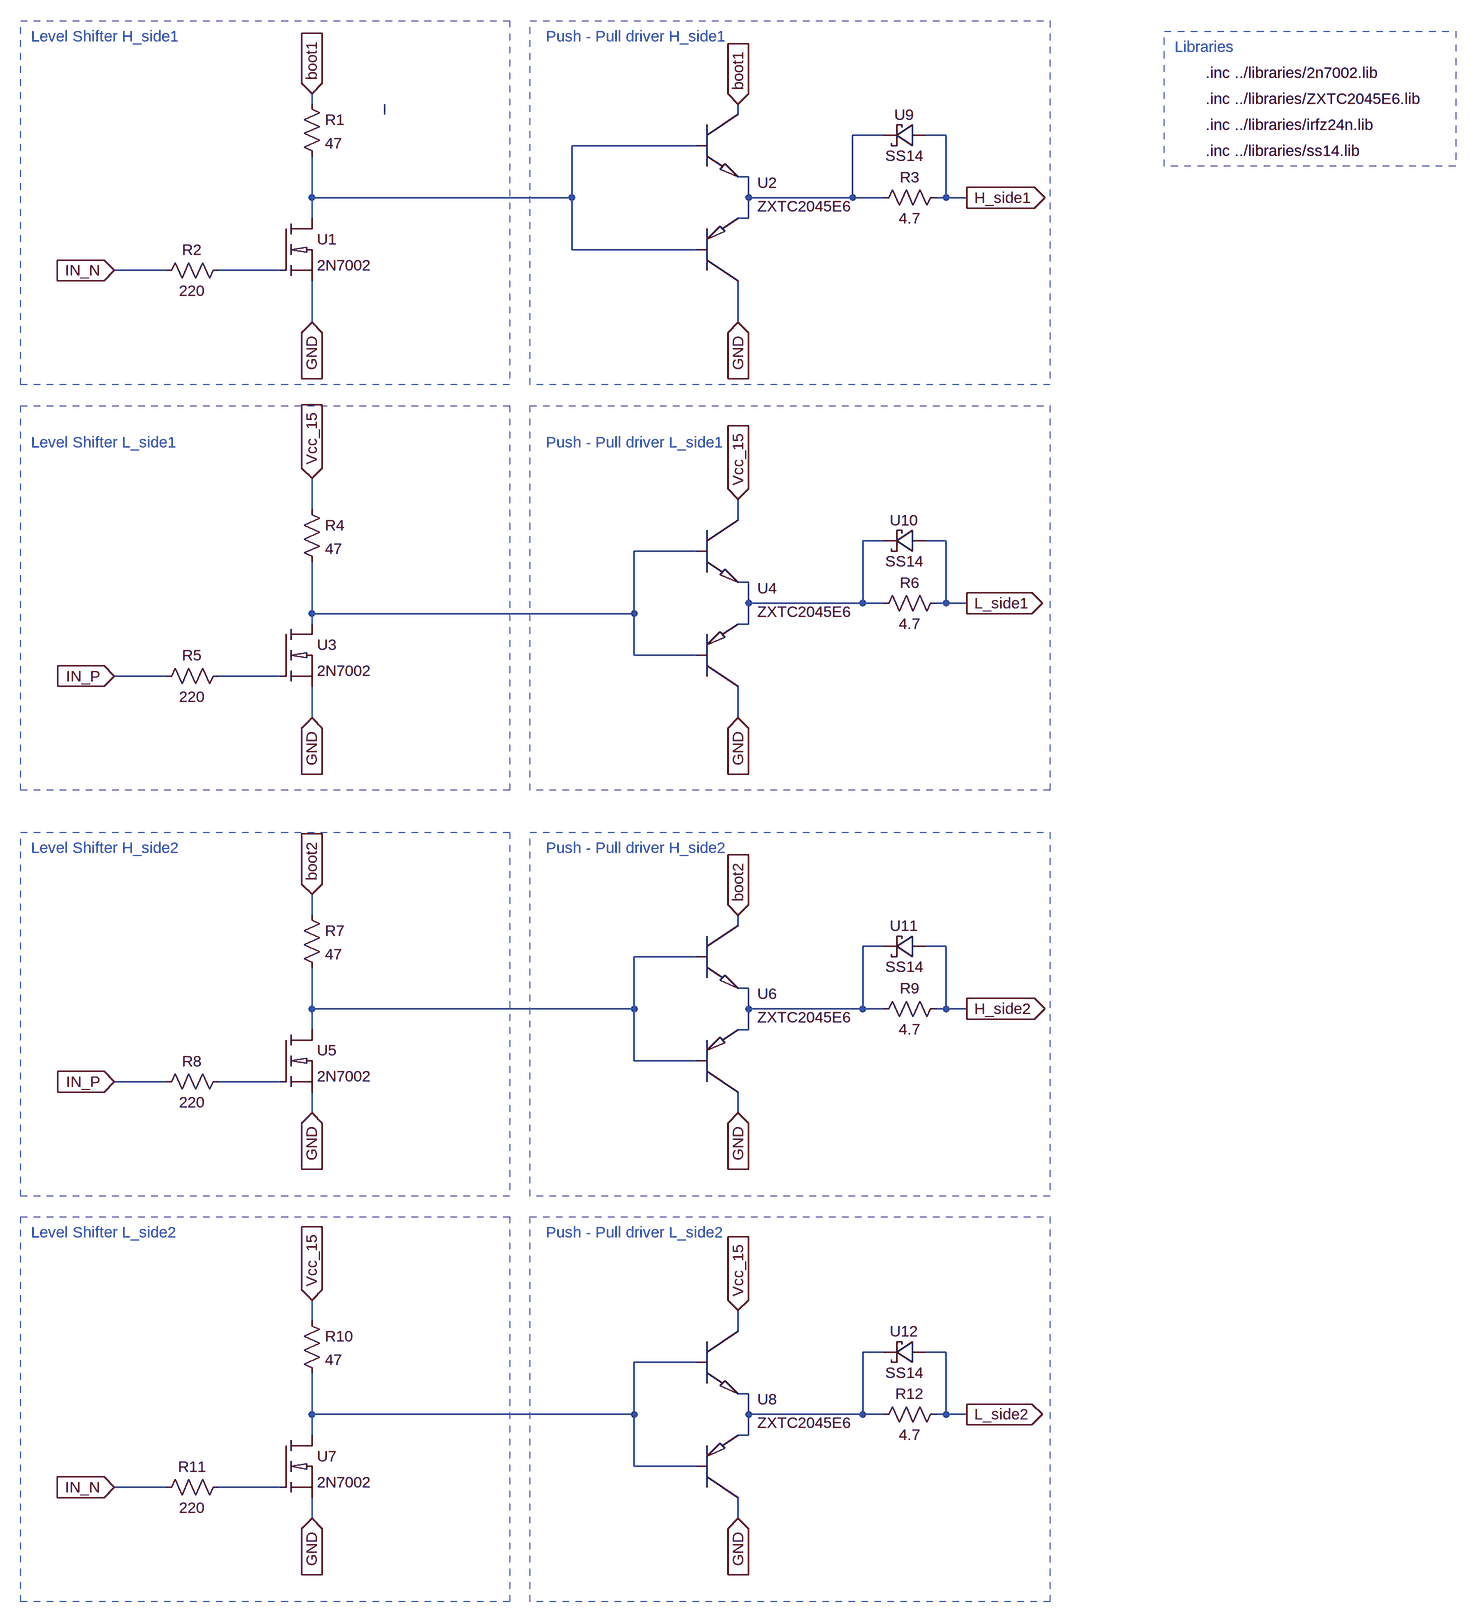
[diagram p0: schematic GateDriver_component.asc]
GateDriver_component.asc, the LTspice schematic file:
Version 4
SHEET 1 3956 2420
WIRE -384 112 -384 96
WIRE -272 128 -272 112
WIRE 272 128 272 112
WIRE 496 160 448 160
WIRE 592 160 560 160
WIRE 208 176 16 176
WIRE 288 224 272 224
WIRE -384 256 -384 192
WIRE 16 256 16 176
WIRE 16 256 -384 256
WIRE 288 256 288 224
WIRE 448 256 448 160
WIRE 448 256 288 256
WIRE 496 256 448 256
WIRE 592 256 592 160
WIRE 592 256 576 256
WIRE 624 256 592 256
WIRE -384 288 -384 256
WIRE 288 288 288 256
WIRE 288 288 272 288
WIRE 16 336 16 256
WIRE 208 336 16 336
WIRE -608 368 -688 368
WIRE -432 368 -528 368
WIRE -384 448 -384 384
WIRE 272 448 272 384
WIRE -384 736 -384 688
WIRE 272 752 272 720
WIRE 496 784 464 784
WIRE 592 784 560 784
WIRE 208 800 112 800
WIRE 288 848 272 848
WIRE 288 880 288 848
WIRE 464 880 464 784
WIRE 464 880 288 880
WIRE 496 880 464 880
WIRE 592 880 592 784
WIRE 592 880 576 880
WIRE 624 880 592 880
WIRE -384 896 -384 816
WIRE 112 896 112 800
WIRE 112 896 -384 896
WIRE -384 912 -384 896
WIRE 288 912 288 880
WIRE 288 912 272 912
WIRE 112 960 112 896
WIRE 208 960 112 960
WIRE -608 992 -688 992
WIRE -432 992 -528 992
WIRE -384 1056 -384 1008
WIRE 272 1056 272 1008
WIRE -384 1360 -384 1328
WIRE 272 1376 272 1360
WIRE 496 1408 464 1408
WIRE 592 1408 560 1408
WIRE 208 1424 112 1424
WIRE 288 1472 272 1472
WIRE -384 1504 -384 1440
WIRE 112 1504 112 1424
WIRE 112 1504 -384 1504
WIRE 288 1504 288 1472
WIRE 464 1504 464 1408
WIRE 464 1504 288 1504
WIRE 496 1504 464 1504
WIRE 592 1504 592 1408
WIRE 592 1504 576 1504
WIRE 624 1504 592 1504
WIRE -384 1536 -384 1504
WIRE 288 1536 288 1504
WIRE 288 1536 272 1536
WIRE 112 1584 112 1504
WIRE 208 1584 112 1584
WIRE -608 1616 -688 1616
WIRE -432 1616 -528 1616
WIRE -384 1664 -384 1632
WIRE 272 1664 272 1632
WIRE -384 1984 -384 1952
WIRE 272 2000 272 1968
WIRE 496 2032 464 2032
WIRE 592 2032 560 2032
WIRE 208 2048 112 2048
WIRE 288 2096 272 2096
WIRE -384 2128 -384 2064
WIRE 112 2128 112 2048
WIRE 112 2128 -384 2128
WIRE 288 2128 288 2096
WIRE 464 2128 464 2032
WIRE 464 2128 288 2128
WIRE 496 2128 464 2128
WIRE 592 2128 592 2032
WIRE 592 2128 576 2128
WIRE 624 2128 592 2128
WIRE -384 2160 -384 2128
WIRE 288 2160 288 2128
WIRE 288 2160 272 2160
WIRE 112 2208 112 2128
WIRE 208 2208 112 2208
WIRE -608 2240 -688 2240
WIRE -432 2240 -528 2240
WIRE -384 2288 -384 2256
WIRE 272 2288 272 2256
FLAG -688 368 IN_N
IOPIN -688 368 In
FLAG -384 96 boot1
IOPIN -384 96 In
FLAG 272 112 boot1
IOPIN 272 112 In
FLAG 624 256 H_side1
IOPIN 624 256 Out
FLAG -688 992 IN_P
IOPIN -688 992 In
FLAG -384 688 Vcc_15
IOPIN -384 688 In
FLAG 272 720 Vcc_15
IOPIN 272 720 In
FLAG 624 880 L_side1
IOPIN 624 880 Out
FLAG -688 1616 IN_P
IOPIN -688 1616 In
FLAG -384 1328 boot2
IOPIN -384 1328 In
FLAG 272 1360 boot2
IOPIN 272 1360 In
FLAG 624 1504 H_side2
IOPIN 624 1504 Out
FLAG -688 2240 IN_N
IOPIN -688 2240 In
FLAG -384 1952 Vcc_15
IOPIN -384 1952 In
FLAG 272 1968 Vcc_15
IOPIN 272 1968 In
FLAG 624 2128 L_side2
IOPIN 624 2128 Out
FLAG -384 448 GND
IOPIN -384 448 In
FLAG 272 448 GND
IOPIN 272 448 In
FLAG -384 1056 GND
IOPIN -384 1056 In
FLAG 272 1056 GND
IOPIN 272 1056 In
FLAG -384 1664 GND
IOPIN -384 1664 In
FLAG 272 1664 GND
IOPIN 272 1664 In
FLAG -384 2288 GND
IOPIN -384 2288 In
FLAG 272 2288 GND
IOPIN 272 2288 In
SYMBOL 2n7002 -432 288 R0
SYMATTR InstName U1
SYMBOL res -400 96 R0
SYMATTR InstName R1
SYMATTR Value 47
SYMBOL res -512 352 R90
WINDOW 0 0 56 VBottom 2
WINDOW 3 32 56 VTop 2
SYMATTR InstName R2
SYMATTR Value 220
SYMBOL ZXTC2045E6 208 144 R0
SYMATTR InstName U2
SYMBOL res 592 240 R90
WINDOW 0 0 56 VBottom 2
WINDOW 3 32 56 VTop 2
SYMATTR InstName R3
SYMATTR Value 4.7
SYMBOL 2n7002 -432 912 R0
SYMATTR InstName U3
SYMBOL res -400 720 R0
SYMATTR InstName R4
SYMATTR Value 47
SYMBOL res -512 976 R90
WINDOW 0 0 56 VBottom 2
WINDOW 3 32 56 VTop 2
SYMATTR InstName R5
SYMATTR Value 220
SYMBOL ZXTC2045E6 208 768 R0
SYMATTR InstName U4
SYMBOL res 592 864 R90
WINDOW 0 0 56 VBottom 2
WINDOW 3 32 56 VTop 2
SYMATTR InstName R6
SYMATTR Value 4.7
SYMBOL 2n7002 -432 1536 R0
SYMATTR InstName U5
SYMBOL res -400 1344 R0
SYMATTR InstName R7
SYMATTR Value 47
SYMBOL res -512 1600 R90
WINDOW 0 0 56 VBottom 2
WINDOW 3 32 56 VTop 2
SYMATTR InstName R8
SYMATTR Value 220
SYMBOL ZXTC2045E6 208 1392 R0
SYMATTR InstName U6
SYMBOL res 592 1488 R90
WINDOW 0 0 56 VBottom 2
WINDOW 3 32 56 VTop 2
SYMATTR InstName R9
SYMATTR Value 4.7
SYMBOL 2n7002 -432 2160 R0
SYMATTR InstName U7
SYMBOL res -400 1968 R0
SYMATTR InstName R10
SYMATTR Value 47
SYMBOL res -512 2224 R90
WINDOW 0 0 56 VBottom 2
WINDOW 3 32 56 VTop 2
SYMATTR InstName R11
SYMATTR Value 220
SYMBOL ZXTC2045E6 208 2016 R0
SYMATTR InstName U8
SYMBOL res 592 2112 R90
WINDOW 0 0 56 VBottom 2
WINDOW 3 32 56 VTop 2
SYMATTR InstName R12
SYMATTR Value 4.7
SYMBOL SS14 560 144 R90
WINDOW 0 0 32 VBottom 2
WINDOW 3 32 32 VTop 2
SYMATTR InstName U9
SYMBOL SS14 560 768 R90
WINDOW 0 0 32 VBottom 2
WINDOW 3 32 32 VTop 2
SYMATTR InstName U10
SYMBOL SS14 560 1392 R90
WINDOW 0 0 32 VBottom 2
WINDOW 3 32 32 VTop 2
SYMATTR InstName U11
SYMBOL SS14 560 2016 R90
WINDOW 0 0 32 VBottom 2
WINDOW 3 32 32 VTop 2
SYMATTR InstName U12
TEXT 992 64 Left 2 !.inc ../libraries/2n7002.lib
TEXT -816 8 Left 2 ;Level Shifter H_side1
TEXT -24 8 Left 2 ;Push - Pull driver H_side1
TEXT -816 632 Left 2 ;Level Shifter L_side1
TEXT -24 632 Left 2 ;Push - Pull driver L_side1
TEXT 992 104 Left 2 !.inc ../libraries/ZXTC2045E6.lib
TEXT -816 1256 Left 2 ;Level Shifter H_side2
TEXT -24 1256 Left 2 ;Push - Pull driver H_side2
TEXT -816 1848 Left 2 ;Level Shifter L_side2
TEXT -24 1848 Left 2 ;Push - Pull driver L_side2
TEXT 992 144 Left 2 !.inc ../libraries/irfz24n.lib
TEXT 944 24 Left 2 ;Libraries
TEXT 992 184 Left 2 !.inc ../libraries/ss14.lib
RECTANGLE Normal -80 544 -832 -16 2
RECTANGLE Normal 752 544 -48 -16 2
RECTANGLE Normal -80 1168 -832 576 2
RECTANGLE Normal 752 1168 -48 576 2
RECTANGLE Normal -80 1792 -832 1232 2
RECTANGLE Normal 752 1792 -48 1232 2
RECTANGLE Normal -80 2416 -832 1824 2
RECTANGLE Normal 752 2416 -48 1824 2
RECTANGLE Normal 1376 208 928 0 2

The netlist it stands for:
* GateDriver_component.asc
XU1 N003 N004 GND 2N7002  ; pins D G S
R1 boot1 N003 47
R2 N004 IN_N 220
XU2 boot1 N003 GND N002 N003 N002 ZXTC2045E6  ; pins C B C1 E1 B1 E
R3 H_side1 N002 4.7
XU3 N006 N007 GND 2N7002  ; pins D G S
R4 Vcc_15 N006 47
R5 N007 IN_P 220
XU4 Vcc_15 N006 GND N005 N006 N005 ZXTC2045E6  ; pins C B C1 E1 B1 E
R6 L_side1 N005 4.7
XU5 N009 N010 GND 2N7002  ; pins D G S
R7 boot2 N009 47
R8 N010 IN_P 220
XU6 boot2 N009 GND N008 N009 N008 ZXTC2045E6  ; pins C B C1 E1 B1 E
R9 H_side2 N008 4.7
XU7 N012 N013 GND 2N7002  ; pins D G S
R10 Vcc_15 N012 47
R11 N013 IN_N 220
XU8 Vcc_15 N012 GND N011 N012 N011 ZXTC2045E6  ; pins C B C1 E1 B1 E
R12 L_side2 N011 4.7
XU9 H_side1 N002 SS14  ; pins + -
XU10 L_side1 N005 SS14  ; pins + -
XU11 H_side2 N008 SS14  ; pins + -
XU12 L_side2 N011 SS14  ; pins + -
.inc ../libraries/2n7002.lib
* Level Shifter H_side1
* Push - Pull driver H_side1
* Level Shifter L_side1
* Push - Pull driver L_side1
.inc ../libraries/ZXTC2045E6.lib
* Level Shifter H_side2
* Push - Pull driver H_side2
* Level Shifter L_side2
* Push - Pull driver L_side2
.inc ../libraries/irfz24n.lib
* Libraries
.inc ../libraries/ss14.lib
.backanno
.end